# EAGLE schematic VC8E (EAGLE 6.6.0)

## Sheet 1 of 3
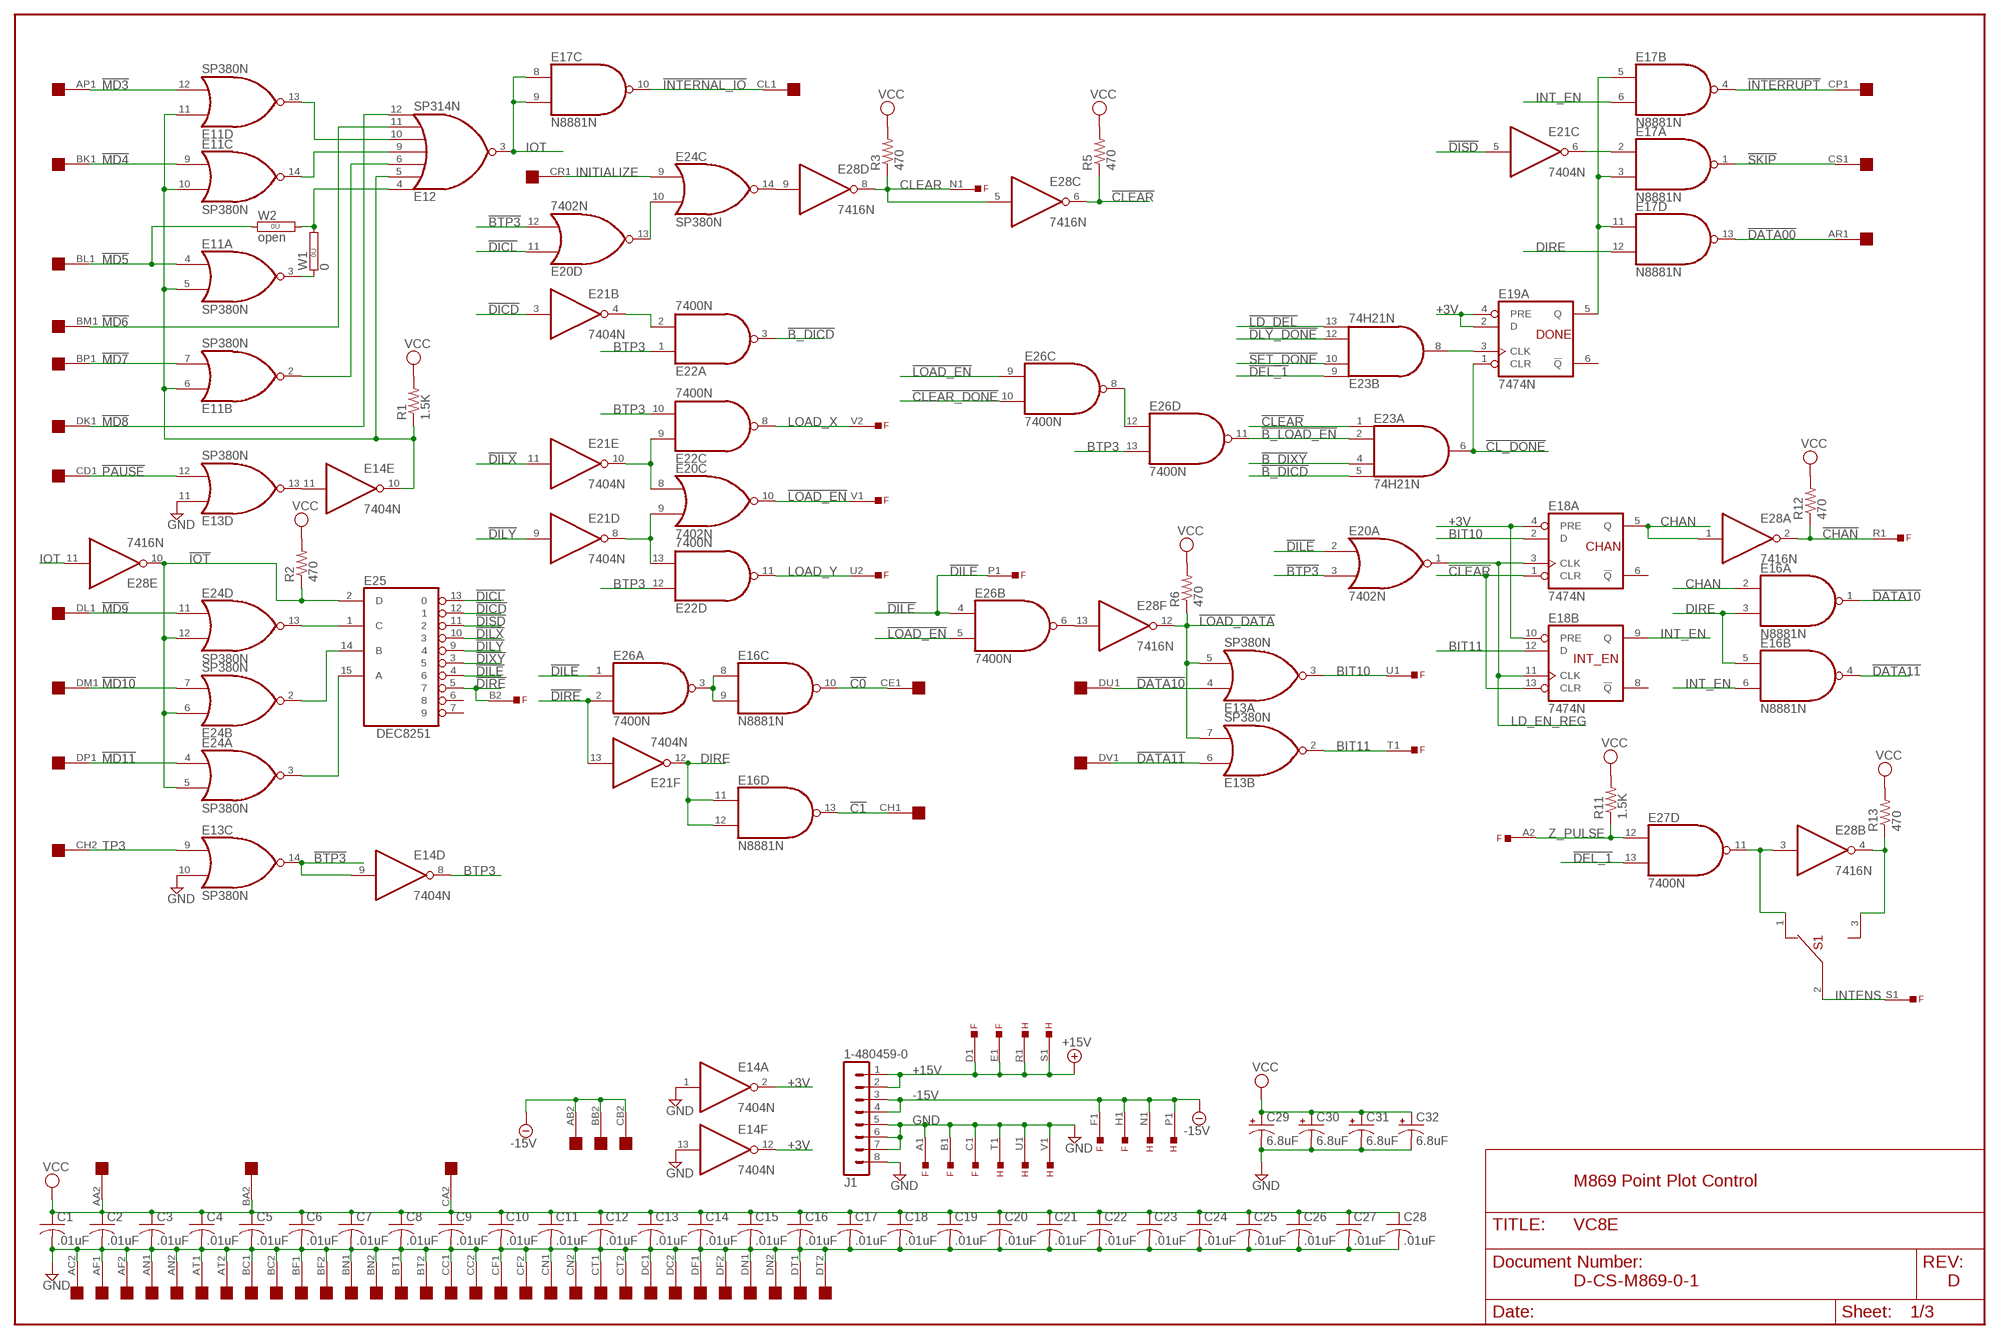
[diagram p0: schematic, sheet 1]

### Parts
C1  .01uF  C-US  [C063-025X075]
C2  .01uF  C-US  [C063-025X075]
C3  .01uF  C-US  [C063-025X075]
C4  .01uF  C-US  [C063-025X075]
C5  .01uF  C-US  [C063-025X075]
C6  .01uF  C-US  [C063-025X075]
C7  .01uF  C-US  [C063-025X075]
C8  .01uF  C-US  [C063-025X075]
C9  .01uF  C-US  [C063-025X075]
C10  .01uF  C-US  [C063-025X075]
C11  .01uF  C-US  [C063-025X075]
C12  .01uF  C-US  [C063-025X075]
C13  .01uF  C-US  [C063-025X075]
C14  .01uF  C-US  [C063-025X075]
C15  .01uF  C-US  [C063-025X075]
C16  .01uF  C-US  [C063-025X075]
C17  .01uF  C-US  [C063-025X075]
C18  .01uF  C-US  [C063-025X075]
C19  .01uF  C-US  [C063-025X075]
C20  .01uF  C-US  [C063-025X075]
C21  .01uF  C-US  [C063-025X075]
C22  .01uF  C-US  [C063-025X075]
C23  .01uF  C-US  [C063-025X075]
C24  .01uF  C-US  [C063-025X075]
C25  .01uF  C-US  [C063-025X075]
C26  .01uF  C-US  [C063-025X075]
C27  .01uF  C-US  [C063-025X075]
C28  .01uF  C-US  [C063-025X075]
C29  6.8uF  CPOL-USE20-8AXIAL  [E12-8]
C30  6.8uF  CPOL-USE20-8AXIAL  [E12-8]
C31  6.8uF  CPOL-USE20-8AXIAL  [E12-8]
C32  6.8uF  CPOL-USE20-8AXIAL  [E12-8]
E11  SP380N  [DIL14]
E12  SP314N  [DIL14]
E13  SP380N  [DIL14]
E14  7404N  [DIL14]
E16  N8881N  [DIL14]
E17  N8881N  [DIL14]
E18  7474N  74S74N  [DIL14]
E19  7474N  74S74N  [DIL14]
E20  7402N  [DIL14]
E21  7404N  [DIL14]
E22  7400N  [DIL14]
E23  74H21N  74LS21N  [DIL14]
E24  SP380N  [DIL14]
E25  DEC8251  [DIL16]
E26  7400N  [DIL14]
E27  7400N  [DIL14]
E28  7416N  [DIL14]
F  EDGE-TOP  [EDGE-CON2]
H  EDGE-TOP  [EDGE-CON2]
J1  1-480459-0  [1-480459-0]
OMNIBUS  QUAD  [EDGE-CON8]
R1  1.5K  R-US_0207/10  [0207/10]
R2  470  R-US_0207/10  [0207/10]
R3  470  R-US_0207/10  [0207/10]
R5  470  R-US_0207/10  [0207/10]
R6  470  R-US_0207/10  [0207/10]
R11  1.5K  R-US_0207/10  [0207/10]
R12  470  R-US_0207/10  [0207/10]
R13  470  R-US_0207/10  [0207/10]
S1  12-09698  [23-021]
W1  0  0R  [0R/10]
W2  open  0R  [0R/10]

### Nets
!B_DICD: E22.3(A:O) E23.5(A:I3)
!B_DIXY: E23.4(A:I2) ; also sheet 2
!B_LOAD_EN: E23.2(A:I1) E26.11(D:O)
!BTP3: E13.14(C:O) E14.9(D:I) E20.3(A:I1) E20.12(D:I1)
!C0: E16.10(C:O) OMNIBUS.CE1
!C1: E16.13(D:O) OMNIBUS.CH1
!CHAN: E28.2(A:O) F.R1 R12.1 ; also sheet 3
!CL_DONE: E19.1(A:CLR) E23.6(A:O)
!CLEAR: E18.1(A:CLR) E18.13(B:CLR) E23.1(A:I0) E28.6(C:O) R5.1 ; also sheet 2
!CLEAR_DONE: E26.10(C:I1) ; also sheet 2
!DATA00: E17.13(D:O) OMNIBUS.AR1
!DATA10: E13.4(A:I0) E16.1(A:O) OMNIBUS.DU1 ; also sheet 3
!DATA11: E13.6(B:I0) E16.4(B:O) OMNIBUS.DV1 ; also sheet 3
!DEL_1: E23.9(B:I0) E27.13(D:I1) ; also sheet 2
!DEL_1Z: E28.4(B:O) R13.1 S1.3(A3)
!DICD: E21.3(B:I) E25.12
!DICL: E20.11(D:I0) E25.13
!DILE: E20.2(A:I0) E25.4 E26.1(A:I0) E26.4(B:I0) F.P1 ; also sheet 3
!DILX: E21.11(E:I) E25.10
!DILY: E21.9(D:I) E25.9
!DIRE: E21.13(F:I) E25.5 E26.2(A:I1) F.B2 ; also sheet 3
!DISD: E21.5(C:I) E25.11
!DIXY: E25.3 ; also sheet 2
!DLY_DONE: E23.12(B:I2) ; also sheet 2
!INTERNAL_IO: E17.10(C:O) OMNIBUS.CL1
!INTERRUPT: E17.4(B:O) OMNIBUS.CP1
!IOT: E24.5(A:I1) E24.6(B:I0) E24.12(D:I1) E25.2(D) E28.10(E:O) R2.1
!LD_DEL: E23.13(B:I3) ; also sheet 2
!LOAD_DATA: E13.5(A:I1) E13.7(B:I1) E28.12(F:O) R6.1 ; also sheet 2
!LOAD_EN: E20.10(C:O) E26.5(B:I1) E26.9(C:I0) F.V1 ; also sheet 2,3
!MD3: E11.12(D:I1) OMNIBUS.AP1
!MD4: E11.9(C:I0) OMNIBUS.BK1
!MD5: E11.4(A:I0) OMNIBUS.BL1 W2.1
!MD6: E12.11(I5) OMNIBUS.BM1
!MD7: E11.7(B:I1) OMNIBUS.BP1
!MD8: E12.12(I6) OMNIBUS.DK1
!MD9: E24.11(D:I0) OMNIBUS.DL1
!MD10: E24.7(B:I1) OMNIBUS.DM1
!MD11: E24.4(A:I0) OMNIBUS.DP1
!PAUSE: E13.12(D:I1) OMNIBUS.CD1
!SET_DONE: E23.10(B:I1) ; also sheet 2
!SKIP: E17.1(A:O) OMNIBUS.CS1
+3V: E14.2(A:O) E14.12(F:O) E18.4(A:PRE) E18.10(B:PRE) E19.2(A:D) E19.4(A:PRE) ; also sheet 2
+15V: F.D1 F.E1 H.R1 H.S1 J1.1 J1.2 ; also sheet 3
-15V [supply]: F.F1 F.H1 H.N1 H.P1 J1.3 J1.4 OMNIBUS.AB2 OMNIBUS.BB2 OMNIBUS.CB2 ; also sheet 3
BIT10: E13.3(A:O) E18.2(A:D) F.U1 ; also sheet 3
BIT11: E13.2(B:O) E18.12(B:D) F.T1 ; also sheet 3
BTP3: E14.8(D:O) E22.1(A:I0) E22.10(C:I1) E22.12(D:I0) E26.13(D:I1) ; also sheet 2
CHAN: E16.2(A:I0) E18.5(A:Q) E28.1(A:I)
CLEAR: E28.5(C:I) E28.8(D:O) F.N1 R3.1 ; also sheet 2,3
DEL_1Z: E27.11(D:O) E28.3(B:I) S1.1(A1)
DICD: E21.4(B:O) E22.2(A:I1)
DILX: E20.8(C:I0) E21.10(E:O) E22.9(C:I0)
DILY: E20.9(C:I1) E21.8(D:O) E22.13(D:I1)
DIRE: E16.3(A:I1) E16.5(B:I0) E16.11(D:I0) E16.12(D:I1) E17.12(D:I1) E21.12(F:O) ; also sheet 2
DISD: E17.2(A:I0) E21.6(C:O)
GND [supply]: C1.2 C2.2 C3.2 C4.2 C5.2 C6.2 C7.2 C8.2 C9.2 C10.2 C11.2 C12.2 C13.2 C14.2 C15.2 C16.2 C17.2 C18.2 C19.2 C20.2 C21.2 C22.2 C23.2 C24.2 C25.2 C26.2 C27.2 C28.2 C29.- C30.- C31.- C32.- E13.10(C:I1) E13.11(D:I0) E14.1(A:I) E14.13(F:I) F.A1 F.B1 F.C1 H.T1 H.U1 H.V1 J1.5 J1.6 J1.7 J1.8 OMNIBUS.AC2 OMNIBUS.AF1 OMNIBUS.AF2 OMNIBUS.AN1 OMNIBUS.AN2 OMNIBUS.AT1 OMNIBUS.AT2 OMNIBUS.BC1 OMNIBUS.BC2 OMNIBUS.BF1 OMNIBUS.BF2 OMNIBUS.BN1 OMNIBUS.BN2 OMNIBUS.BT1 OMNIBUS.BT2 OMNIBUS.CC1 OMNIBUS.CC2 OMNIBUS.CF1 OMNIBUS.CF2 OMNIBUS.CN1 OMNIBUS.CN2 OMNIBUS.CT1 OMNIBUS.CT2 OMNIBUS.DC1 OMNIBUS.DC2 OMNIBUS.DF1 OMNIBUS.DF2 OMNIBUS.DN1 OMNIBUS.DN2 OMNIBUS.DT1 OMNIBUS.DT2 ; also sheet 2,3
INITIALIZE: E24.9(C:I0) OMNIBUS.CR1
INT_EN: E16.6(B:I1) E17.6(B:I1) E18.9(B:Q)
INTENS: F.S1 S1.2(A2) ; also sheet 3
IO3: E11.13(D:O) E12.10(I4)
IO4: E11.14(C:O) E12.9(I3)
IO5: E12.4(I0) W1.2 W2.2
IO7: E11.2(B:O) E12.6(I2)
IOT: E12.3(O) E17.8(C:I0) E17.9(C:I1) E28.11(E:I)
LD_EN_REG: E18.3(A:CLK) E18.11(B:CLK) E20.1(A:O) ; also sheet 2
LOAD_X: E22.8(C:O) F.V2 ; also sheet 3
LOAD_Y: E22.11(D:O) F.U2 ; also sheet 3
MD5: E11.3(A:O) W1.1
N$1: E17.3(A:I1) E17.5(B:I0) E17.11(D:I0) E19.5(A:Q)
N$2: E26.8(C:O) E26.12(D:I0)
N$3: E19.3(A:CLK) E23.8(B:O)
N$4: E16.8(C:I0) E16.9(C:I1) E26.3(A:O)
N$5: E26.6(B:O) E28.13(F:I)
N$16: E13.13(D:O) E14.11(E:I)
N$18: E24.14(C:O) E28.9(D:I)
N$19: E24.3(A:O) E25.15(A)
N$20: E24.2(B:O) E25.14(B)
N$21: E24.13(D:O) E25.1(C)
N$23: E20.13(D:O) E24.10(C:I1)
PAUSE_L: E11.5(A:I1) E11.6(B:I0) E11.10(C:I1) E11.11(D:I0) E12.5(I1) E14.10(E:O) R1.1
TP3: E13.9(C:I0) OMNIBUS.CH2
VCC [supply]: C1.1 C2.1 C3.1 C4.1 C5.1 C6.1 C7.1 C8.1 C9.1 C10.1 C11.1 C12.1 C13.1 C14.1 C15.1 C16.1 C17.1 C18.1 C19.1 C20.1 C21.1 C22.1 C23.1 C24.1 C25.1 C26.1 C27.1 C28.1 C29.+ C30.+ C31.+ C32.+ OMNIBUS.AA2 OMNIBUS.BA2 OMNIBUS.CA2 R1.2 R2.2 R3.2 R5.2 R6.2 R11.2 R12.2 R13.2 ; also sheet 2,3
Z_PULSE: E27.12(D:I0) F.A2 R11.1 ; also sheet 3
Unconnected: E14.3(B:I) E14.4(B:O) E14.5(C:I) E14.6(C:O) E18.6(A:!Q) E18.8(B:!Q) E19.6(A:!Q) E19.8(B:!Q) E19.9(B:Q) E19.10(B:PRE) E19.11(B:CLK) E19.12(B:D) E19.13(B:CLR) E20.4(B:O) E20.5(B:I0) E20.6(B:I1) E25.6 E25.7 E27.1(A:I0) E27.2(A:I1) E27.3(A:O) E27.4(B:I0) E27.5(B:I1) E27.6(B:O) E27.8(C:O) E27.9(C:I0) E27.10(C:I1) F.E2 F.F2 F.H2 F.J1 F.J2 F.K2 F.L2 F.M2 F.N2 F.P2 F.R2 F.S2 F.T2 H.A1 H.A2 H.B1 H.B2 H.C1 H.C2 H.D1 H.D2 H.E1 H.E2 H.F1 H.F2 H.H1 H.H2 H.J1 H.J2 H.K1 H.K2 H.L1 H.L2 H.M1 H.M2 H.N2 H.P2 H.R2 H.S2 H.T2 H.U2 H.V2 OMNIBUS.AA1 OMNIBUS.AB1 OMNIBUS.AC1 OMNIBUS.AD1 OMNIBUS.AD2 OMNIBUS.AE1 OMNIBUS.AE2 OMNIBUS.AH1 OMNIBUS.AH2 OMNIBUS.AJ1 OMNIBUS.AJ2 OMNIBUS.AK1 OMNIBUS.AK2 OMNIBUS.AL1 OMNIBUS.AL2 OMNIBUS.AM1 OMNIBUS.AM2 OMNIBUS.AP2 OMNIBUS.AR2 OMNIBUS.AS1 OMNIBUS.AS2 OMNIBUS.AU1 OMNIBUS.AU2 OMNIBUS.AV1 OMNIBUS.AV2 OMNIBUS.BA1 OMNIBUS.BB1 OMNIBUS.BD1 OMNIBUS.BD2 OMNIBUS.BE1 OMNIBUS.BE2 OMNIBUS.BH1 OMNIBUS.BH2 OMNIBUS.BJ1 OMNIBUS.BJ2 OMNIBUS.BK2 OMNIBUS.BL2 OMNIBUS.BM2 OMNIBUS.BP2 OMNIBUS.BR1 OMNIBUS.BR2 OMNIBUS.BS1 OMNIBUS.BS2 OMNIBUS.BU2 OMNIBUS.BV2 OMNIBUS.CA1 OMNIBUS.CB1 OMNIBUS.CD2 OMNIBUS.CE2 OMNIBUS.CJ1 OMNIBUS.CJ2 OMNIBUS.CK1 OMNIBUS.CK2 OMNIBUS.CL2 OMNIBUS.CM1 OMNIBUS.CM2 OMNIBUS.CP2 OMNIBUS.CR2 OMNIBUS.CS2 OMNIBUS.CU1 OMNIBUS.CU2 OMNIBUS.CV1 OMNIBUS.CV2 OMNIBUS.DA1 OMNIBUS.DA2 OMNIBUS.DB1 OMNIBUS.DB2 OMNIBUS.DD1 OMNIBUS.DD2 OMNIBUS.DE1 OMNIBUS.DE2 OMNIBUS.DH1 OMNIBUS.DH2 OMNIBUS.DJ1 OMNIBUS.DJ2 OMNIBUS.DK2 OMNIBUS.DL2 OMNIBUS.DM2 OMNIBUS.DP2 OMNIBUS.DR2 OMNIBUS.DS2 OMNIBUS.DU2 OMNIBUS.DV2

### Notes on the sheet
- DONE
- CHAN
- INT_EN
- M869 Point Plot Control
- D-CS-M869-0-1 | D

## Sheet 2 of 3
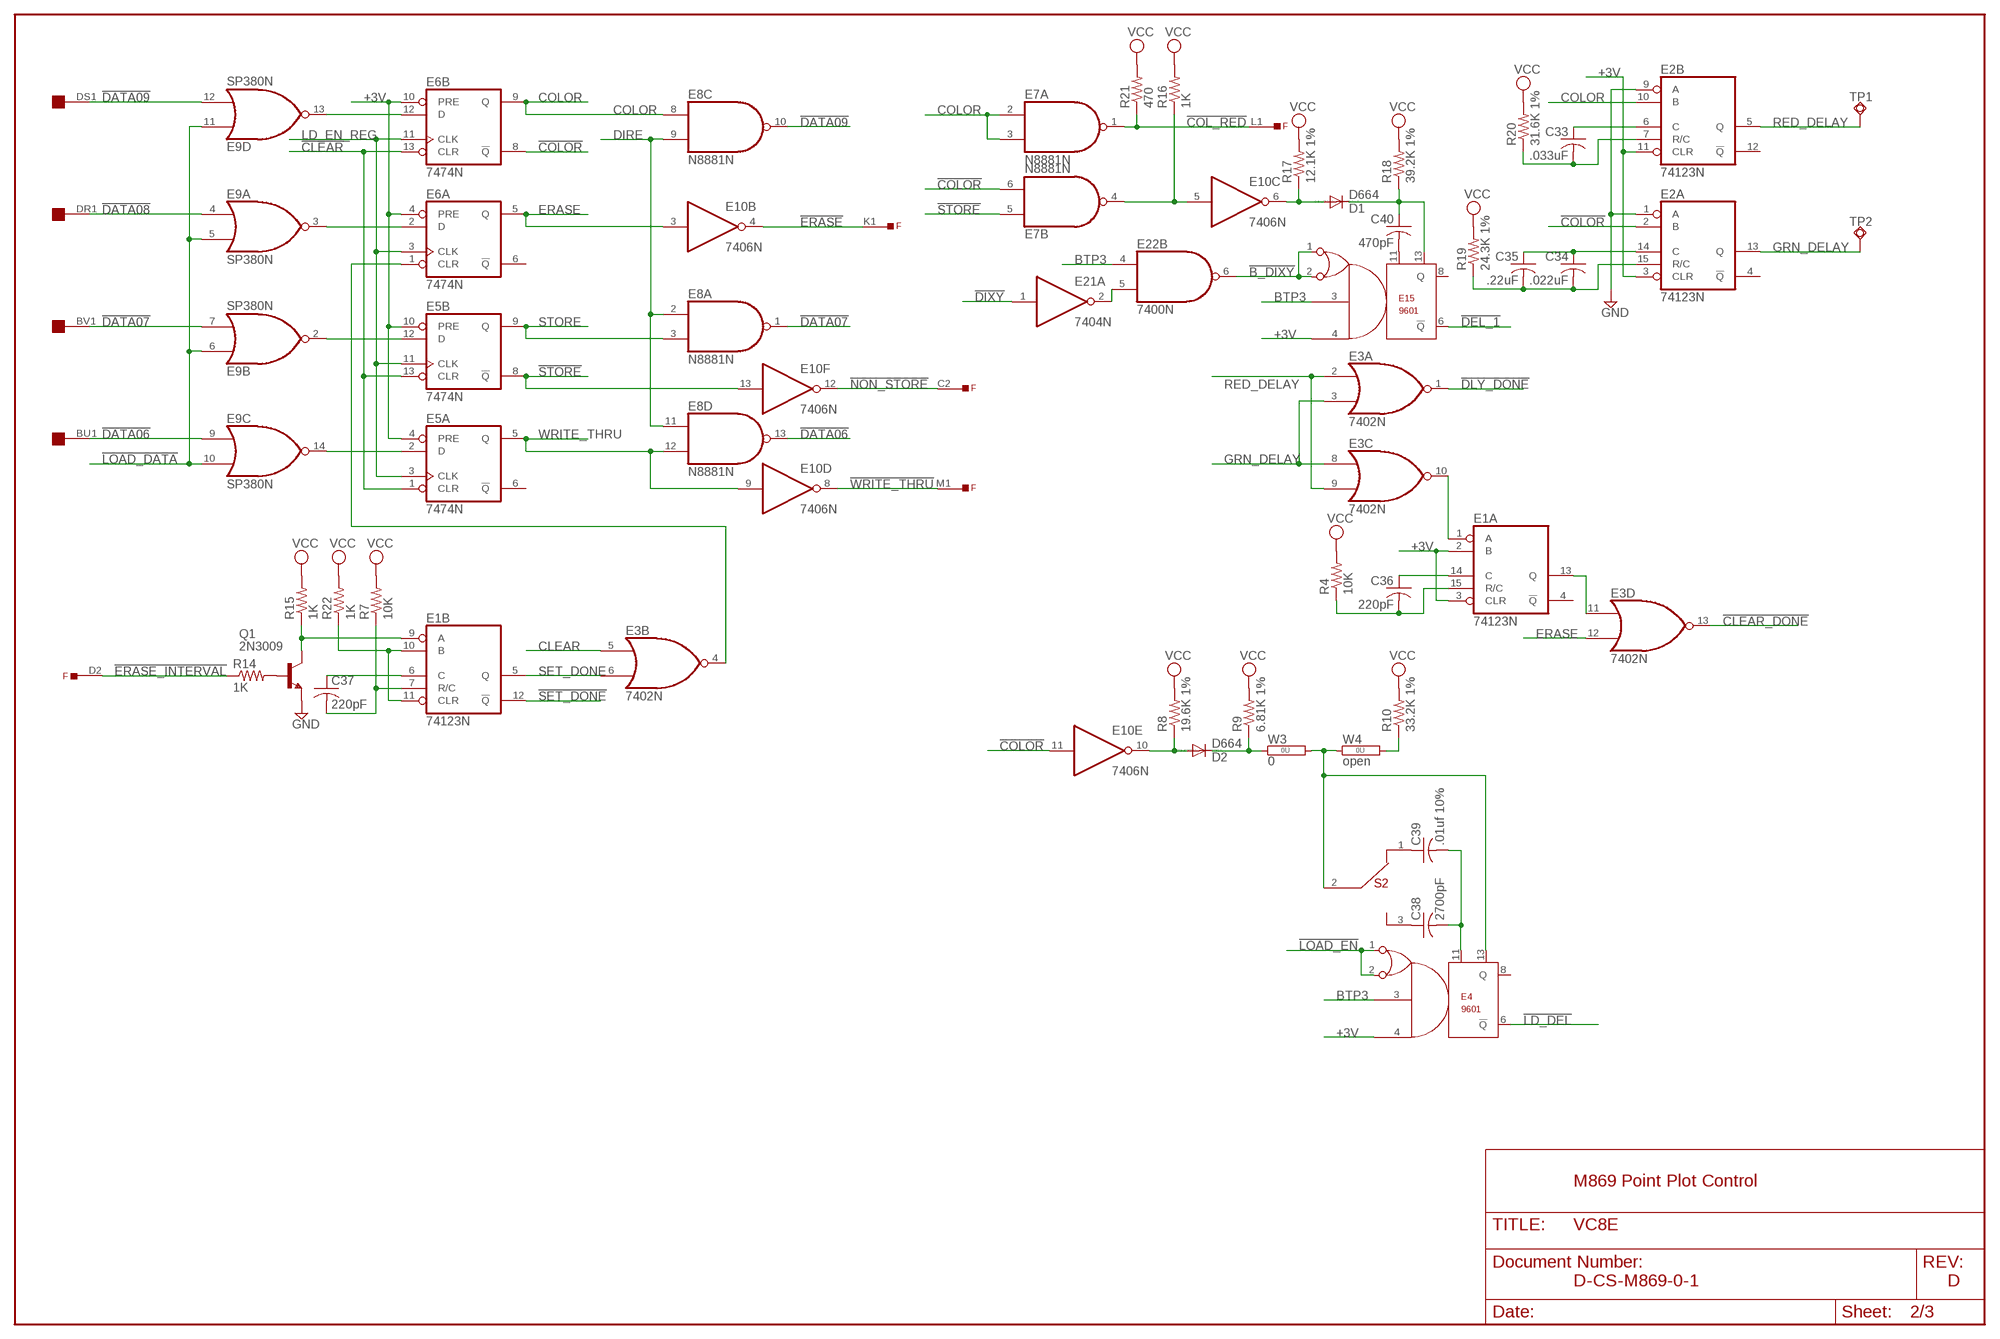
[diagram p1: schematic, sheet 2]

### Parts
C33  .033uF  C-US325-137X374  [C325-137X374]
C34  .022uF  C-US8  [C203-054-229]
C35  .22uF  C-US8  [C203-054-229]
C36  220pF  C-US  [C063-025X075]
C37  220pF  C-US  [C063-025X075]
C38  2700pF  C-US102-043X133  [C102-043X133]
C39  .01uf 10%  C-US  [C063-025X075]
C40  470pF  C-US  [C063-025X075]
D1  D664  DIODE-DO35-10  [DO35-10]
D2  D664  DIODE-DO35-10  [DO35-10]
E1  74123N  [DIL16]
E2  74123N  [DIL16]
E3  7402N  [DIL14]
E4  9601  [DIL14]
E5  7474N  74S74N  [DIL14]
E6  7474N  74S74N  [DIL14]
E7  N8881N  [DIL14]
E8  N8881N  [DIL14]
E9  SP380N  [DIL14]
E10  7406N  [DIL14]
E15  9601  [DIL14]
Q1  2N3009  -NPN-TO18-  [TO18-]
R4  10K  R-US_0207/10  [0207/10]
R7  10K  R-US_0207/10  [0207/10]
R8  19.6K 1%  R-US_0207/15  [0207/15]
R9  6.81K 1%  R-US_0207/15  [0207/15]
R10  33.2K 1%  R-US_0207/15  [0207/15]
R14  1K  R-US_0207/10  [0207/10]
R15  1K  R-US_0207/10  [0207/10]
R16  1K  R-US_0207/10  [0207/10]
R17  12.1K 1%  R-US_0207/15  [0207/15]
R18  39.2K 1%  R-US_0207/15  [0207/15]
R19  24.3K 1%  R-US_0207/15  [0207/15]
R20  31.6K 1%  R-US_0207/15  [0207/15]
R21  470  R-US_0207/10  [0207/10]
R22  1K  R-US_0207/10  [0207/10]
S2  12-09698  [23-021]
TP1  TPSQPAD1-17  [P1-17]
TP2  TPSQPAD1-17  [P1-17]
W3  0  0R  [0R/10]
W4  open  0R  [0R/10]

### Nets
!B_DIXY: E15.1 E15.2 E22.6(B:O) ; also sheet 1
!CLEAR: E5.1(A:CLR) E5.13(B:CLR) E6.13(B:CLR) ; also sheet 1
!CLEAR_DONE: E3.13(D:O) ; also sheet 1
!COL_RED: E7.1(A:O) F.L1 R21.1 ; also sheet 3
!COLOR: E2.2(A:B) E6.8(B:!Q) E7.6(B:I1) E10.11(E:I)
!DATA06: E8.13(D:O) E9.9(C:I0) OMNIBUS.BU1 ; also sheet 3
!DATA07: E8.1(A:O) E9.7(B:I1) OMNIBUS.BV1 ; also sheet 3
!DATA08: E9.4(A:I0) OMNIBUS.DR1 ; also sheet 3
!DATA09: E8.10(C:O) E9.12(D:I1) OMNIBUS.DS1 ; also sheet 3
!DEL_1: E15.6(!Q) ; also sheet 1
!DIXY: E21.1(A:I) ; also sheet 1
!DLY_DONE: E3.1(A:O) ; also sheet 1
!ERASE: E10.4(B:O) F.K1 ; also sheet 3
!ERASE_INTERVAL: F.D2 R14.1 ; also sheet 3
!LD_DEL: E4.6(!Q) ; also sheet 1
!LOAD_DATA: E9.5(A:I1) E9.6(B:I0) E9.10(C:I1) E9.11(D:I0) ; also sheet 1
!LOAD_EN: E4.1 E4.2 ; also sheet 1,3
!NON_STORE: E10.12(F:O) F.C2 ; also sheet 3
!SET_DONE: E1.12(B:!Q) ; also sheet 1
!STORE: E5.8(B:!Q) E7.5(B:I0) E10.13(F:I)
!WRITE_THRU: E10.8(D:O) F.M1 ; also sheet 3
+3V: E1.2(A:B) E1.3(A:CLR) E2.3(A:CLR) E2.11(B:CLR) E4.4 E5.4(A:PRE) E5.10(B:PRE) E6.4(A:PRE) E6.10(B:PRE) E15.4 ; also sheet 1
BCOLOR: D2.A E10.10(E:O) R8.1
BTP3: E4.3 E15.3 E22.4(B:I0) ; also sheet 1
CLEAR: E3.5(B:I0) ; also sheet 1,3
COLOR: E2.10(B:B) E6.9(B:Q) E7.2(A:I0) E7.3(A:I1) E8.8(C:I0)
DDELAY: E1.13(A:Q) E3.11(D:I0)
DIRE: E8.2(A:I0) E8.9(C:I1) E8.11(D:I0) ; also sheet 1
DLY_DN: E1.1(A:A) E3.10(C:O)
ERASE: E3.12(D:I1) E6.5(A:Q) E10.3(B:I)
GDELAY: D1.A E10.6(C:O) R17.1
GND [supply]: E2.1(A:A) E2.9(B:A) Q1.1(E) ; also sheet 1,3
GRN_DELAY: E2.13(A:Q) E3.3(A:I1) E3.8(C:I0) TP2.TP
LD_EN_REG: E5.3(A:CLK) E5.11(B:CLK) E6.3(A:CLK) E6.11(B:CLK) ; also sheet 1
N$7: E21.2(A:O) E22.5(B:I1)
N$11: E6.12(B:D) E9.13(D:O)
N$13: E5.2(A:D) E9.14(C:O)
N$22: E5.12(B:D) E9.2(B:O)
N$24: E6.2(A:D) E9.3(A:O)
N$25: E7.4(B:O) E10.5(C:I) R16.1
N$26: E3.4(B:O) E6.1(A:CLR)
N$28: C40.1 D1.C E15.13 R18.1
N$29: C40.2 E15.11
N$30: C34.2 C35.2 E2.15(A:R/C) R19.1
N$31: C33.2 E2.7(B:R/C) R20.1
N$32: C33.1 E2.6(B:C)
N$33: C34.1 C35.1 E2.14(A:C)
N$36: C36.2 E1.15(A:R/C) R4.1
N$37: C36.1 E1.14(A:C)
N$38: Q1.2(B) R14.2
N$39: E1.9(B:A) Q1.3(C) R15.1
N$40: E1.10(B:B) E1.11(B:CLR) R22.1
N$41: C37.2 E1.7(B:R/C) R7.1
N$42: C37.1 E1.6(B:C)
N$44: D2.C R9.1 W3.1
N$45: E4.13 S2.2(A2) W3.2 W4.1
N$46: R10.1 W4.2
N$47: C39.1 S2.1(A1)
N$48: C38.1 S2.3(A3)
N$49: C38.2 C39.2 E4.11
RED_DELAY: E2.5(B:Q) E3.2(A:I0) E3.9(C:I1) TP1.TP
SET_DONE: E1.5(B:Q) E3.6(B:I1)
STORE: E5.9(B:Q) E8.3(A:I1)
VCC [supply]: R4.2 R7.2 R8.2 R9.2 R10.2 R15.2 R16.2 R17.2 R18.2 R19.2 R20.2 R21.2 R22.2 ; also sheet 1,3
WRITE_THRU: E5.5(A:Q) E8.12(D:I1) E10.9(D:I)
Unconnected: E1.4(A:!Q) E2.4(A:!Q) E2.12(B:!Q) E4.8(Q) E5.6(A:!Q) E6.6(A:!Q) E7.8(C:I0) E7.9(C:I1) E7.10(C:O) E7.11(D:I0) E7.12(D:I1) E7.13(D:O) E8.4(B:O) E8.5(B:I0) E8.6(B:I1) E10.1(A:I) E10.2(A:O) E15.8(Q)

### Notes on the sheet
- M869 Point Plot Control
- D-CS-M869-0-1 | D

## Sheet 3 of 3
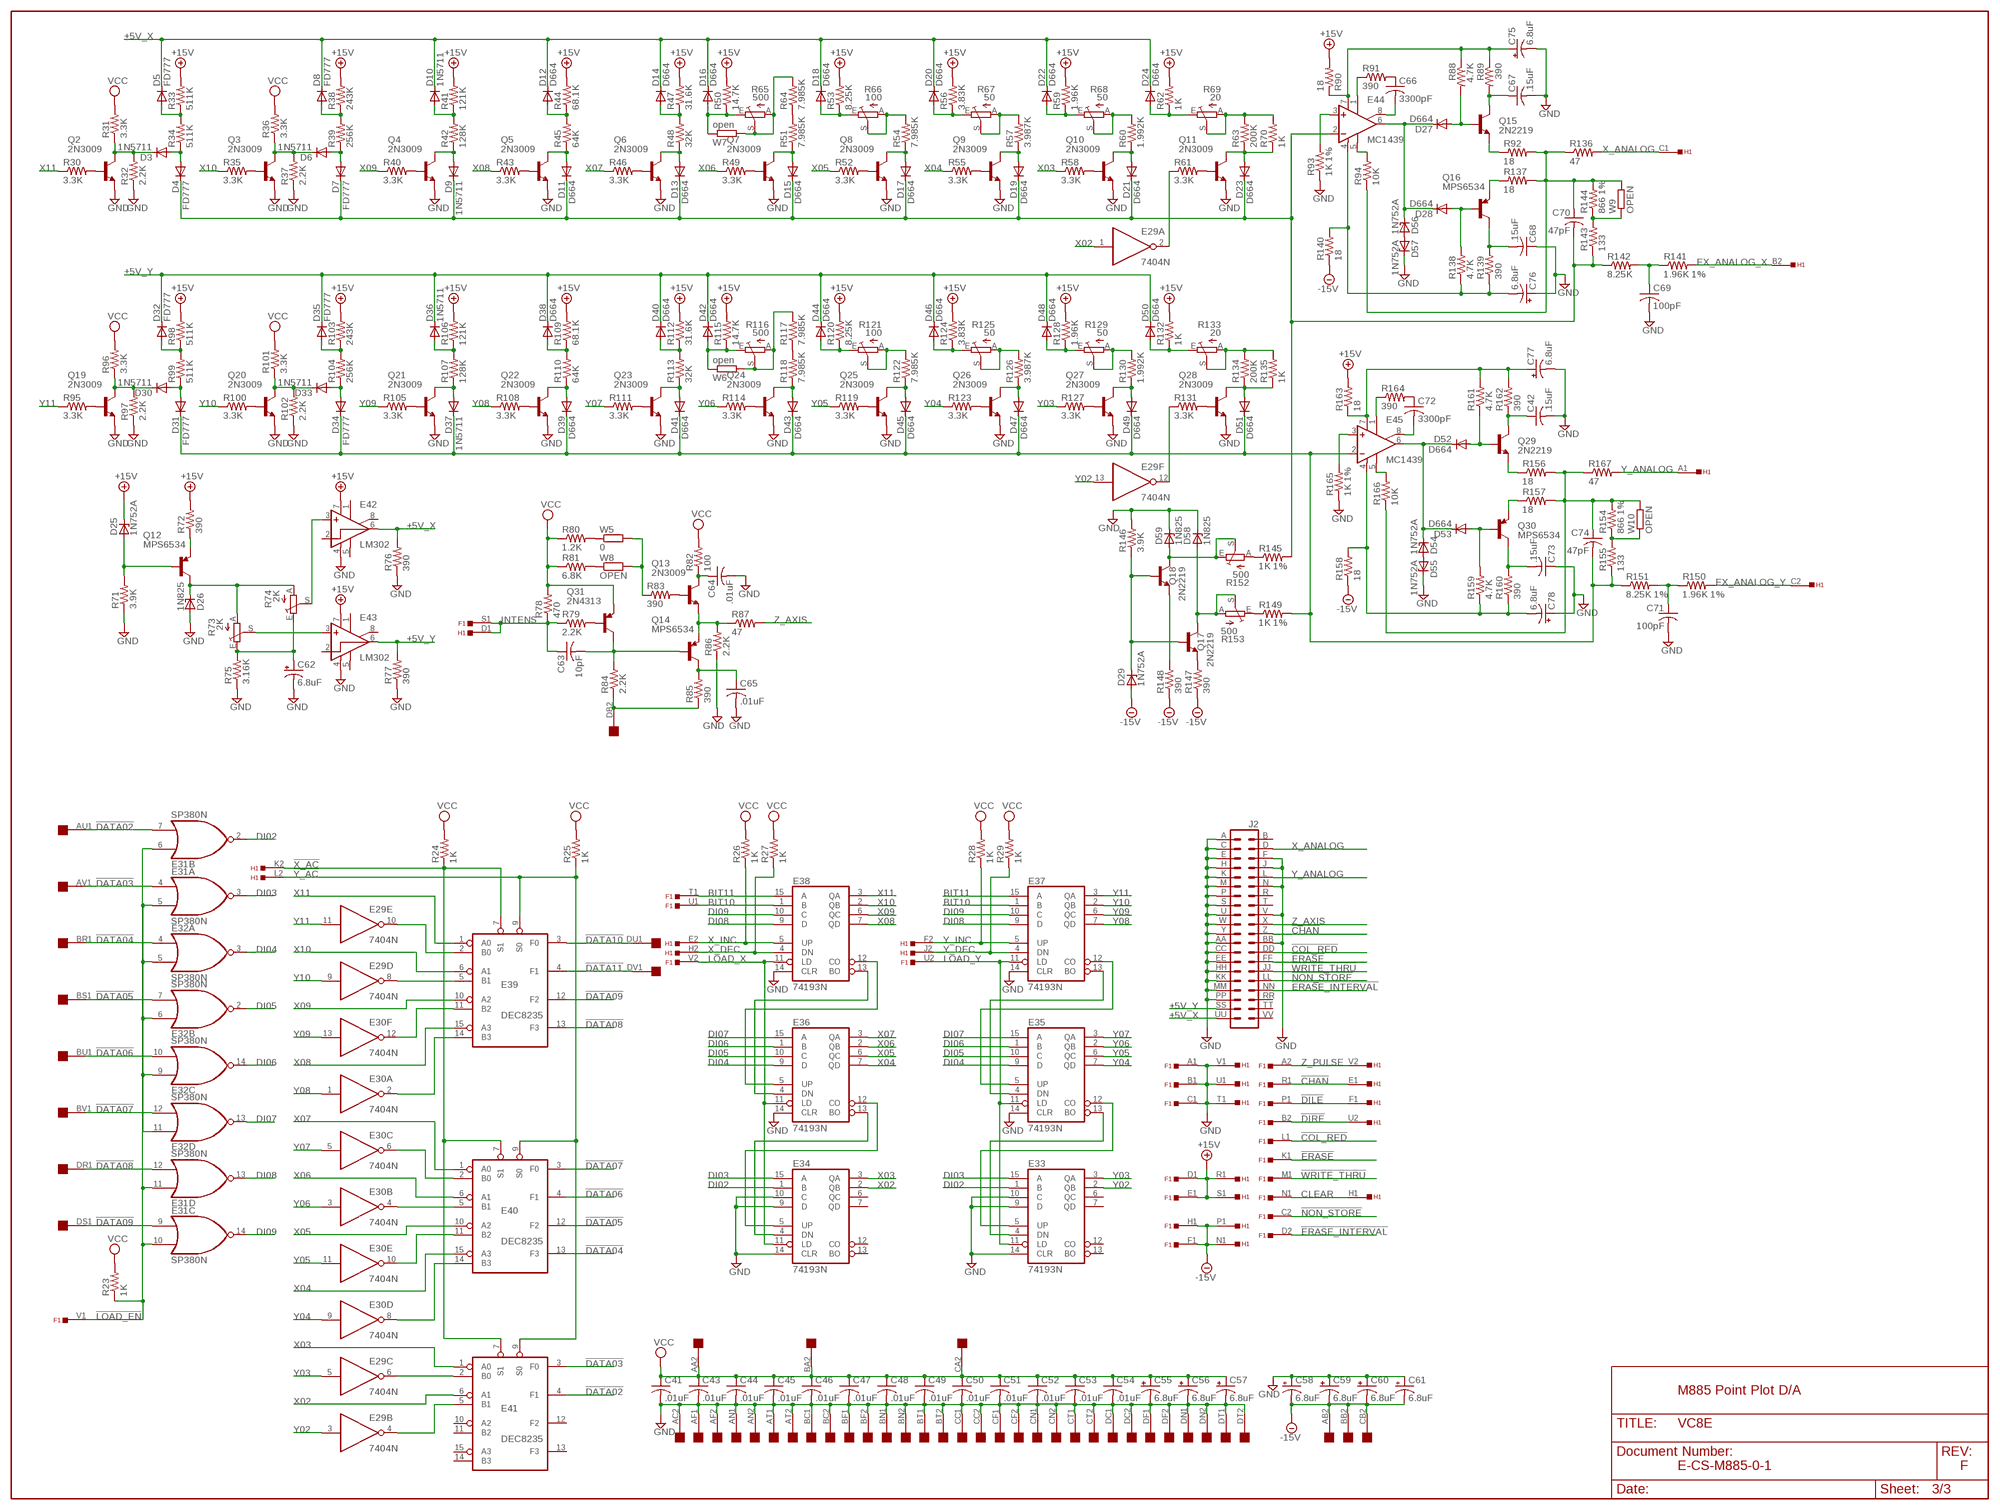
[diagram p2: schematic, sheet 3]

### Parts
C41  .01uF  C-US  [C063-025X075]
C42  .15uF  C-US150-054X183  [C150-054X183]
C43  .01uF  C-US  [C063-025X075]
C44  .01uF  C-US  [C063-025X075]
C45  .01uF  C-US  [C063-025X075]
C46  .01uF  C-US  [C063-025X075]
C47  .01uF  C-US  [C063-025X075]
C48  .01uF  C-US  [C063-025X075]
C49  .01uF  C-US  [C063-025X075]
C50  .01uF  C-US  [C063-025X075]
C51  .01uF  C-US  [C063-025X075]
C52  .01uF  C-US  [C063-025X075]
C53  .01uF  C-US  [C063-025X075]
C54  .01uF  C-US  [C063-025X075]
C55  6.8uF  CPOL-USE20-8AXIAL  [E12-8]
C56  6.8uF  CPOL-USE20-8AXIAL  [E12-8]
C57  6.8uF  CPOL-USE20-8AXIAL  [E12-8]
C58  6.8uF  CPOL-USE20-8AXIAL  [E12-8]
C59  6.8uF  CPOL-USE20-8AXIAL  [E12-8]
C60  6.8uF  CPOL-USE20-8AXIAL  [E12-8]
C61  6.8uF  CPOL-USE20-8AXIAL  [E12-8]
C62  6.8uF  CPOL-USE20-8AXIAL  [E12-8]
C63  10pF  C-US  [C063-025X075]
C64  .01uF  C-US  [C063-025X075]
C65  .01uF  C-US  [C063-025X075]
C66  3300pF  C-US150-054X183  [C150-054X183]
C67  .15uF  C-US150-054X183  [C150-054X183]
C68  .15uF  C-US150-054X183  [C150-054X183]
C69  100pF  C-US  [C063-025X075]
C70  47pF  C-US  [C063-025X075]
C71  100pF  C-US  [C063-025X075]
C72  3300pF  C-US150-054X183  [C150-054X183]
C73  .15uF  C-US150-054X183  [C150-054X183]
C74  47pF  C-US  [C063-025X075]
C75  6.8uF  CPOL-USE20-8AXIAL  [E12-8]
C76  6.8uF  CPOL-USE20-8AXIAL  [E12-8]
C77  6.8uF  CPOL-USE20-8AXIAL  [E12-8]
C78  6.8uF  CPOL-USE20-8AXIAL  [E12-8]
D3  1N5711  DIODE-DO35-10  [DO35-10]
D4  FD777  DIODE-DO35-10  [DO35-10]
D5  FD777  DIODE-DO35-10  [DO35-10]
D6  1N5711  DIODE-DO35-10  [DO35-10]
D7  FD777  DIODE-DO35-10  [DO35-10]
D8  FD777  DIODE-DO35-10  [DO35-10]
D9  1N5711  DIODE-DO35-10  [DO35-10]
D10  1N5711  DIODE-DO35-10  [DO35-10]
D11  D664  DIODE-DO35-10  [DO35-10]
D12  D664  DIODE-DO35-10  [DO35-10]
D13  D664  DIODE-DO35-10  [DO35-10]
D14  D664  DIODE-DO35-10  [DO35-10]
D15  D664  DIODE-DO35-10  [DO35-10]
D16  D664  DIODE-DO35-10  [DO35-10]
D17  D664  DIODE-DO35-10  [DO35-10]
D18  D664  DIODE-DO35-10  [DO35-10]
D19  D664  DIODE-DO35-10  [DO35-10]
D20  D664  DIODE-DO35-10  [DO35-10]
D21  D664  DIODE-DO35-10  [DO35-10]
D22  D664  DIODE-DO35-10  [DO35-10]
D23  D664  DIODE-DO35-10  [DO35-10]
D24  D664  DIODE-DO35-10  [DO35-10]
D25  1N752A  ZENER-DIODEDO35Z10  [DO35Z10]
D26  1N825  ZENER-DIODEDO35Z10  [DO35Z10]
D27  D664  DIODE-DO35-10  [DO35-10]
D28  D664  DIODE-DO35-10  [DO35-10]
D29  1N752A  ZENER-DIODEDO35Z10  [DO35Z10]
D30  1N5711  DIODE-DO35-10  [DO35-10]
D31  FD777  DIODE-DO35-10  [DO35-10]
D32  FD777  DIODE-DO35-10  [DO35-10]
D33  1N5711  DIODE-DO35-10  [DO35-10]
D34  FD777  DIODE-DO35-10  [DO35-10]
D35  FD777  DIODE-DO35-10  [DO35-10]
D36  1N5711  DIODE-DO35-10  [DO35-10]
D37  1N5711  DIODE-DO35-10  [DO35-10]
D38  D664  DIODE-DO35-10  [DO35-10]
D39  D664  DIODE-DO35-10  [DO35-10]
D40  D664  DIODE-DO35-10  [DO35-10]
D41  D664  DIODE-DO35-10  [DO35-10]
D42  D664  DIODE-DO35-10  [DO35-10]
D43  D664  DIODE-DO35-10  [DO35-10]
D44  D664  DIODE-DO35-10  [DO35-10]
D45  D664  DIODE-DO35-10  [DO35-10]
D46  D664  DIODE-DO35-10  [DO35-10]
D47  D664  DIODE-DO35-10  [DO35-10]
D48  D664  DIODE-DO35-10  [DO35-10]
D49  D664  DIODE-DO35-10  [DO35-10]
D50  D664  DIODE-DO35-10  [DO35-10]
D51  D664  DIODE-DO35-10  [DO35-10]
D52  D664  DIODE-DO35-10  [DO35-10]
D53  D664  DIODE-DO35-10  [DO35-10]
D54  1N752A  ZENER-DIODEDO35Z10  [DO35Z10]
D55  1N752A  ZENER-DIODEDO35Z10  [DO35Z10]
D56  1N752A  ZENER-DIODEDO35Z10  [DO35Z10]
D57  1N752A  ZENER-DIODEDO35Z10  [DO35Z10]
D58  1N825  ZENER-DIODEDO35Z10  [DO35Z10]
D59  1N825  ZENER-DIODEDO35Z10  [DO35Z10]
E29  7404N  [DIL14]
E30  7404N  [DIL14]
E31  SP380N  [DIL14]
E32  SP380N  [DIL14]
E33  74193N  [DIL16]
E34  74193N  [DIL16]
E35  74193N  [DIL16]
E36  74193N  [DIL16]
E37  74193N  [DIL16]
E38  74193N  [DIL16]
E39  DEC8235  [DIL16]
E40  DEC8235  [DIL16]
E41  DEC8235  [DIL16]
E42  LM302  AD504H  [TO99]
E43  LM302  AD504H  [TO99]
E44  MC1439  AD504H  [TO99]
E45  MC1439  AD504H  [TO99]
F1  EDGE-TOP  [EDGE-CON2]
H1  EDGE-TOP  [EDGE-CON2]
J2  DEC40PINH  [DEC40PINH]
OMNIBUS1  QUAD  [EDGE-CON8]
Q2  2N3009  -NPN-TO5  [TO5]
Q3  2N3009  -NPN-TO5  [TO5]
Q4  2N3009  -NPN-TO5  [TO5]
Q5  2N3009  -NPN-TO5  [TO5]
Q6  2N3009  -NPN-TO5  [TO5]
Q7  2N3009  -NPN-TO5  [TO5]
Q8  2N3009  -NPN-TO5  [TO5]
Q9  2N3009  -NPN-TO5  [TO5]
Q10  2N3009  -NPN-TO5  [TO5]
Q11  2N3009  -NPN-TO5  [TO5]
Q12  MPS6534  -PNP-TO5  [TO5]
Q13  2N3009  -NPN-TO5  [TO5]
Q14  MPS6534  -PNP-TO5  [TO5]
Q15  2N2219  -NPN-TO5  [TO5]
Q16  MPS6534  -PNP-TO5  [TO5]
Q17  2N2219  -NPN-TO5  [TO5]
Q18  2N2219  -NPN-TO5  [TO5]
Q19  2N3009  -NPN-TO5  [TO5]
Q20  2N3009  -NPN-TO5  [TO5]
Q21  2N3009  -NPN-TO5  [TO5]
Q22  2N3009  -NPN-TO5  [TO5]
Q23  2N3009  -NPN-TO5  [TO5]
Q24  2N3009  -NPN-TO5  [TO5]
Q25  2N3009  -NPN-TO5  [TO5]
Q26  2N3009  -NPN-TO5  [TO5]
Q27  2N3009  -NPN-TO5  [TO5]
Q28  2N3009  -NPN-TO5  [TO5]
Q29  2N2219  -NPN-TO5  [TO5]
Q30  MPS6534  -PNP-TO5  [TO5]
Q31  2N4313  -PNP-TO5  [TO5]
R23  1K  R-US_0207/10  [0207/10]
R24  1K  R-US_0207/10  [0207/10]
R25  1K  R-US_0207/10  [0207/10]
R26  1K  R-US_0207/10  [0207/10]
R27  1K  R-US_0207/10  [0207/10]
R28  1K  R-US_0207/10  [0207/10]
R29  1K  R-US_0207/10  [0207/10]
R30  3.3K  R-US_0207/10  [0207/10]
R31  3.3K  R-US_0207/10  [0207/10]
R32  2.2K  R-US_0207/10  [0207/10]
R33  511K  R-US_0207/15  [0207/15]
R34  511K  R-US_0207/15  [0207/15]
R35  3.3K  R-US_0207/10  [0207/10]
R36  3.3K  R-US_0207/10  [0207/10]
R37  2.2K  R-US_0207/10  [0207/10]
R38  243K  R-US_0207/15  [0207/15]
R39  256K  R-US_0207/15  [0207/15]
R40  3.3K  R-US_0207/10  [0207/10]
R41  121K  R-US_0207/15  [0207/15]
R42  128K  R-US_0207/15  [0207/15]
R43  3.3K  R-US_0207/10  [0207/10]
R44  68.1K  R-US_0207/15  [0207/15]
R45  64K  R-US_0207/15  [0207/15]
R46  3.3K  R-US_0207/10  [0207/10]
R47  31.6K  R-US_0207/15  [0207/15]
R48  32K  R-US_0207/15  [0207/15]
R49  3.3K  R-US_0207/10  [0207/10]
R50  14.7K  R-US_0207/15  [0207/15]
R51  7.985K  R-US_0207/15  [0207/15]
R52  3.3K  R-US_0207/10  [0207/10]
R53  8.25K  R-US_0207/15  [0207/15]
R54  7.985K  R-US_0207/15  [0207/15]
R55  3.3K  R-US_0207/10  [0207/10]
R56  3.83K  R-US_0207/15  [0207/15]
R57  3.987K  R-US_0207/15  [0207/15]
R58  3.3K  R-US_0207/10  [0207/10]
R59  1.96K  R-US_0207/15  [0207/15]
R60  1.992K  R-US_0207/15  [0207/15]
R61  3.3K  R-US_0207/10  [0207/10]
R62  1K  R-US_0207/15  [0207/15]
R63  200K  R-US_0207/15  [0207/15]
R64  7.985K  R-US_0207/15  [0207/15]
R65  500  TRIM_EU-S75P  [S75P]
R66  100  TRIM_EU-S75P  [S75P]
R67  50  TRIM_EU-S75P  [S75P]
R68  50  TRIM_EU-S75P  [S75P]
R69  20  TRIM_EU-S75P  [S75P]
R70  1K  R-US_0207/15  [0207/15]
R71  3.9K  R-US_0207/10  [0207/10]
R72  390  R-US_0207/10  [0207/10]
R73  2K  TRIM_EU-B90P  [SP19L]
R74  2K  TRIM_EU-B90P  [SP19L]
R75  3.16K  R-US_0207/15  [0207/15]
R76  390  R-US_0207/10  [0207/10]
R77  390  R-US_0207/10  [0207/10]
R78  470  R-US_0207/10  [0207/10]
R79  2.2K  R-US_0207/10  [0207/10]
R80  1.2K  R-US_0207/10  [0207/10]
R81  6.8K  R-US_0207/10  [0207/10]
R82  100  R-US_0207/10  [0207/10]
R83  390  R-US_0207/10  [0207/10]
R84  2.2K  R-US_0207/10  [0207/10]
R85  390  R-US_0207/10  [0207/10]
R86  2.2K  R-US_0207/10  [0207/10]
R87  47  R-US_0207/10  [0207/10]
R88  4.7K  R-US_0207/10  [0207/10]
R89  390  R-US_0207/10  [0207/10]
R90  18  R-US_0207/10  [0207/10]
R91  390  R-US_0207/10  [0207/10]
R92  18  R-US_0207/10  [0207/10]
R93  1K 1%  R-US_0207/15  [0207/15]
R94  10K  R-US_0207/10  [0207/10]
R95  3.3K  R-US_0207/10  [0207/10]
R96  3.3K  R-US_0207/10  [0207/10]
R97  2.2K  R-US_0207/10  [0207/10]
R98  511K  R-US_0207/15  [0207/15]
R99  511K  R-US_0207/15  [0207/15]
R100  3.3K  R-US_0207/10  [0207/10]
R101  3.3K  R-US_0207/10  [0207/10]
R102  2.2K  R-US_0207/10  [0207/10]
R103  243K  R-US_0207/15  [0207/15]
R104  256K  R-US_0207/15  [0207/15]
R105  3.3K  R-US_0207/10  [0207/10]
R106  121K  R-US_0207/15  [0207/15]
R107  128K  R-US_0207/15  [0207/15]
R108  3.3K  R-US_0207/10  [0207/10]
R109  68.1K  R-US_0207/15  [0207/15]
R110  64K  R-US_0207/15  [0207/15]
R111  3.3K  R-US_0207/10  [0207/10]
R112  31.6K  R-US_0207/15  [0207/15]
R113  32K  R-US_0207/15  [0207/15]
R114  3.3K  R-US_0207/10  [0207/10]
R115  14.7K  R-US_0207/15  [0207/15]
R116  500  TRIM_EU-S75P  [S75P]
R117  7.985K  R-US_0207/15  [0207/15]
R118  7.985K  R-US_0207/15  [0207/15]
R119  3.3K  R-US_0207/10  [0207/10]
R120  8.25K  R-US_0207/15  [0207/15]
R121  100  TRIM_EU-S75P  [S75P]
R122  7.985K  R-US_0207/15  [0207/15]
R123  3.3K  R-US_0207/10  [0207/10]
R124  3.83K  R-US_0207/15  [0207/15]
R125  50  TRIM_EU-S75P  [S75P]
R126  3.987K  R-US_0207/15  [0207/15]
R127  3.3K  R-US_0207/10  [0207/10]
R128  1.96K  R-US_0207/15  [0207/15]
R129  50  TRIM_EU-S75P  [S75P]
R130  1.992K  R-US_0207/15  [0207/15]
R131  3.3K  R-US_0207/10  [0207/10]
R132  1K  R-US_0207/15  [0207/15]
R133  20  TRIM_EU-S75P  [S75P]
R134  200K  R-US_0207/15  [0207/15]
R135  1K  R-US_0207/15  [0207/15]
R136  47  R-US_0207/10  [0207/10]
R137  18  R-US_0207/10  [0207/10]
R138  4.7K  R-US_0207/10  [0207/10]
R139  390  R-US_0207/10  [0207/10]
R140  18  R-US_0207/10  [0207/10]
R141  1.96K 1%  R-US_0207/15  [0207/15]
R142  8.25K  R-US_0207/15  [0207/15]
R143  133  R-US_0207/15  [0207/15]
R144  866 1%  R-US_0207/15  [0207/15]
R145  1K 1%  R-US_0207/15  [0207/15]
R146  3.9K  R-US_0207/10  [0207/10]
R147  390  R-US_0207/10  [0207/10]
R148  390  R-US_0207/10  [0207/10]
R149  1K 1%  R-US_0207/15  [0207/15]
R150  1.96K 1%  R-US_0207/15  [0207/15]
R151  8.25K 1%  R-US_0207/10  [0207/10]
R152  500  TRIM_EU-B90P  [SP19L]
R153  500  TRIM_EU-B90P  [SP19L]
R154  866 1%  R-US_0207/15  [0207/15]
R155  133  R-US_0207/15  [0207/15]
R156  18  R-US_0207/10  [0207/10]
R157  18  R-US_0207/10  [0207/10]
R158  18  R-US_0207/10  [0207/10]
R159  4.7K  R-US_0207/10  [0207/10]
R160  390  R-US_0207/10  [0207/10]
R161  4.7K  R-US_0207/10  [0207/10]
R162  390  R-US_0207/10  [0207/10]
R163  18  R-US_0207/10  [0207/10]
R164  390  R-US_0207/10  [0207/10]
R165  1K 1%  R-US_0207/15  [0207/15]
R166  10K  R-US_0207/10  [0207/10]
R167  47  R-US_0207/10  [0207/10]
W5  0  R-EU_0207/10  [0207/10]
W6  open  R-EU_0207/10  [0207/10]
W7  open  R-EU_0207/10  [0207/10]
W8  OPEN  R-EU_0207/10  [0207/10]
W9  OPEN  R-EU_0207/10  [0207/10]
W10  OPEN  R-EU_0207/10  [0207/10]

### Nets
!CHAN: F1.R1 H1.E1 J2.Z ; also sheet 1
!COL_RED: F1.L1 J2.DD ; also sheet 2
!DATA02: E31.7(B:I1) E41.4(F1) OMNIBUS1.AU1
!DATA03: E31.4(A:I0) E41.3(F0) OMNIBUS1.AV1
!DATA04: E32.4(A:I0) E40.13(F3) OMNIBUS1.BR1
!DATA05: E32.7(B:I1) E40.12(F2) OMNIBUS1.BS1
!DATA06: E32.10(C:I1) E40.4(F1) OMNIBUS1.BU1 ; also sheet 2
!DATA07: E32.12(D:I1) E40.3(F0) OMNIBUS1.BV1 ; also sheet 2
!DATA08: E31.12(D:I1) E39.13(F3) OMNIBUS1.DR1 ; also sheet 2
!DATA09: E31.9(C:I0) E39.12(F2) OMNIBUS1.DS1 ; also sheet 2
!DATA10: E39.3(F0) OMNIBUS1.DU1 ; also sheet 1
!DATA11: E39.4(F1) OMNIBUS1.DV1 ; also sheet 1
!DILE: F1.P1 H1.F1 ; also sheet 1
!DIRE: F1.B2 H1.U2 ; also sheet 1
!ERASE: F1.K1 J2.FF ; also sheet 2
!ERASE_INTERVAL: F1.D2 J2.NN ; also sheet 2
!LOAD_EN: E31.5(A:I1) E31.6(B:I0) E31.10(C:I1) E31.11(D:I0) E32.5(A:I1) E32.6(B:I0) E32.9(C:I0) E32.11(D:I0) F1.V1 R23.1 ; also sheet 1,2
!NON_STORE: F1.C2 J2.LL ; also sheet 2
!WRITE_THRU: F1.M1 J2.JJ ; also sheet 2
!X_AC: E39.7(S1) E40.7(S1) E41.7(S1) H1.K2 R24.1
!Y_AC: E39.9(S0) E40.9(S0) E41.9(S0) H1.L2 R25.1
+5V_X [supply]: D5.C D8.C D10.C D12.C D14.C D16.C D18.C D20.C D22.C D24.C E42.6(OUT) J2.UU R76.2
+5V_Y [supply]: D32.C D35.C D36.C D38.C D40.C D42.C D44.C D46.C D48.C D50.C E43.6(OUT) J2.SS R77.2
+15V: D25.C E42.7(V+) E43.7(V+) F1.D1 F1.E1 H1.R1 H1.S1 R33.2 R38.2 R41.2 R44.2 R47.2 R50.2 R53.2 R56.2 R59.2 R62.2 R72.2 R90.2 R98.2 R103.2 R106.2 R109.2 R112.2 R115.2 R120.2 R124.2 R128.2 R132.2 R163.2 ; also sheet 1
-15V [supply]: C58.- C59.- C60.- C61.- D29.A F1.F1 F1.H1 H1.N1 H1.P1 OMNIBUS1.AB2 OMNIBUS1.BB2 OMNIBUS1.CB2 R140.1 R147.1 R148.1 R158.1 ; also sheet 1
BIT10: E37.1(B) E38.1(B) F1.U1 ; also sheet 1
BIT11: E37.15(A) E38.15(A) F1.T1 ; also sheet 1
CLEAR: F1.N1 H1.H1 ; also sheet 1,2
DI02: E31.2(B:O) E33.1(B) E34.1(B)
DI03: E31.3(A:O) E33.15(A) E34.15(A)
DI04: E32.3(A:O) E35.9(D) E36.9(D)
DI05: E32.2(B:O) E35.10(C) E36.10(C)
DI06: E32.14(C:O) E35.1(B) E36.1(B)
DI07: E32.13(D:O) E35.15(A) E36.15(A)
DI08: E31.13(D:O) E37.9(D) E38.9(D)
DI09: E31.14(C:O) E37.10(C) E38.10(C)
EX_ANALOG_X: H1.B2 R141.2
EX_ANALOG_Y: H1.C2 R150.2
GND [supply]: C41.2 C42.2 C43.2 C44.2 C45.2 C46.2 C47.2 C48.2 C49.2 C50.2 C51.2 C52.2 C53.2 C54.2 C55.- C56.- C57.- C58.+ C59.+ C60.+ C61.+ C62.- C64.2 C65.2 C67.2 C68.1 C69.2 C71.2 C73.1 C75.- C76.+ C77.- C78.+ D26.A D55.C D57.C D58.C D59.C E33.9(D) E33.10(C) E33.14(CLR) E34.9(D) E34.10(C) E34.14(CLR) E35.14(CLR) E36.14(CLR) E37.14(CLR) E38.14(CLR) E42.4(V-) E43.4(V-) F1.A1 F1.B1 F1.C1 H1.T1 H1.U1 H1.V1 J2.A J2.AA J2.BB J2.C J2.CC J2.E J2.EE J2.F J2.H J2.HH J2.J J2.K J2.KK J2.M J2.MM J2.N J2.P J2.PP J2.S J2.U J2.V J2.W J2.Y OMNIBUS1.AC2 OMNIBUS1.AF1 OMNIBUS1.AF2 OMNIBUS1.AN1 OMNIBUS1.AN2 OMNIBUS1.AT1 OMNIBUS1.AT2 OMNIBUS1.BC1 OMNIBUS1.BC2 OMNIBUS1.BF1 OMNIBUS1.BF2 OMNIBUS1.BN1 OMNIBUS1.BN2 OMNIBUS1.BT1 OMNIBUS1.BT2 OMNIBUS1.CC1 OMNIBUS1.CC2 OMNIBUS1.CF1 OMNIBUS1.CF2 OMNIBUS1.CN1 OMNIBUS1.CN2 OMNIBUS1.CT1 OMNIBUS1.CT2 OMNIBUS1.DC1 OMNIBUS1.DC2 OMNIBUS1.DF1 OMNIBUS1.DF2 OMNIBUS1.DN1 OMNIBUS1.DN2 OMNIBUS1.DT1 OMNIBUS1.DT2 Q2.1(E) Q3.1(E) Q4.1(E) Q5.1(E) Q6.1(E) Q7.1(E) Q8.1(E) Q9.1(E) Q10.1(E) Q11.1(E) Q19.1(E) Q20.1(E) Q21.1(E) Q22.1(E) Q23.1(E) Q24.1(E) Q25.1(E) Q26.1(E) Q27.1(E) Q28.1(E) R32.1 R37.1 R71.1 R75.1 R76.1 R77.1 R86.1 R93.1 R97.1 R102.1 R146.2 R165.1 ; also sheet 1,2
INTENS: C63.1 F1.S1 H1.D1 R78.1 R79.1 ; also sheet 1
LOAD_X: E34.11(LD) E36.11(LD) E38.11(LD) F1.V2 ; also sheet 1
LOAD_Y: E33.11(LD) E35.11(LD) E37.11(LD) F1.U2 ; also sheet 1
N$50: E29.10(E:O) E39.2(B0)
N$51: E29.8(D:O) E39.5(B1)
N$52: E30.12(F:O) E39.11(B2)
N$53: E30.2(A:O) E39.14(B3)
N$54: E30.6(C:O) E40.2(B0)
N$55: E30.4(B:O) E40.5(B1)
N$56: E30.10(E:O) E40.11(B2)
N$57: E30.8(D:O) E40.14(B3)
N$58: E29.6(C:O) E41.2(B0)
N$59: E29.4(B:O) E41.5(B1)
N$60: E34.4(DN) E36.13(BO)
N$61: E34.5(UP) E36.12(CO)
N$62: E36.4(DN) E38.13(BO)
N$63: E36.5(UP) E38.12(CO)
N$64: E33.4(DN) E35.13(BO)
N$65: E33.5(UP) E35.12(CO)
N$66: E35.4(DN) E37.13(BO)
N$67: E35.5(UP) E37.12(CO)
N$68: D5.A R33.1 R34.2
N$69: D3.A D4.A R34.1
N$70: Q2.2(B) R30.2
N$71: D3.C Q2.3(C) R31.1 R32.2
N$72: D8.A R38.1 R39.2
N$73: D6.A D7.A R39.1
N$74: Q3.2(B) R35.2
N$75: D6.C Q3.3(C) R36.1 R37.2
N$76: D10.A R41.1 R42.2
N$77: D9.A Q4.3(C) R42.1
N$78: Q4.2(B) R40.2
N$79: D12.A R44.1 R45.2
N$80: D11.A Q5.3(C) R45.1
N$81: Q5.2(B) R43.2
N$82: D14.A R47.1 R48.2
N$83: D13.A Q6.3(C) R48.1
N$84: Q6.2(B) R46.2
N$85: D15.A Q7.3(C) R51.1
N$86: Q7.2(B) R49.2
N$87: D18.A R53.1 R66.E
N$88: D17.A Q8.3(C) R54.1
N$89: Q8.2(B) R52.2
N$90: R57.2 R67.A R67.S
N$91: D19.A Q9.3(C) R57.1
N$92: Q9.2(B) R55.2
N$93: D22.A R59.1 R68.E
N$94: D21.A Q10.3(C) R60.1
N$95: Q10.2(B) R58.2
N$96: D24.A R62.1 R69.E
N$97: D23.A Q11.3(C) R63.1 R70.1
N$98: Q11.2(B) R61.2
N$99: E29.2(A:O) R61.1
N$100: D16.A R50.1 R65.E W7.1
N$101: R51.2 R64.1
N$102: R64.2 R65.A R65.S W7.2
N$103: R54.2 R66.A R66.S
N$104: D20.A R56.1 R67.E
N$105: R60.2 R68.A R68.S
N$106: R63.2 R69.A R69.S R70.2
N$107: D32.A R98.1 R99.2
N$108: D30.A D31.A R99.1
N$109: Q19.2(B) R95.2
N$110: D30.C Q19.3(C) R96.1 R97.2
N$111: D35.A R103.1 R104.2
N$112: D33.A D34.A R104.1
N$113: C74.2 D31.C D34.C D37.C D39.C D41.C D43.C D45.C D47.C D49.C D51.C E45.2(-IN) R149.2 R151.1 R155.1
N$114: Q20.2(B) R100.2
N$115: D33.C Q20.3(C) R101.1 R102.2
N$116: D36.A R106.1 R107.2
N$117: D37.A Q21.3(C) R107.1
N$118: Q21.2(B) R105.2
N$119: D38.A R109.1 R110.2
N$120: D39.A Q22.3(C) R110.1
N$121: Q22.2(B) R108.2
N$122: D40.A R112.1 R113.2
N$123: D41.A Q23.3(C) R113.1
N$124: Q23.2(B) R111.2
N$125: D43.A Q24.3(C) R118.1
N$126: Q24.2(B) R114.2
N$127: D44.A R120.1 R121.E
N$128: D45.A Q25.3(C) R122.1
N$129: Q25.2(B) R119.2
N$130: R125.A R125.S R126.2
N$131: D47.A Q26.3(C) R126.1
N$132: Q26.2(B) R123.2
N$133: D48.A R128.1 R129.E
N$134: D49.A Q27.3(C) R130.1
N$135: Q27.2(B) R127.2
N$136: D50.A R132.1 R133.E
N$137: D51.A Q28.3(C) R134.1 R135.1
N$138: Q28.2(B) R131.2
N$139: E29.12(F:O) R131.1
N$140: D42.A R115.1 R116.E W6.1
N$141: R117.1 R118.2
N$142: R116.A R116.S R117.2 W6.2
N$143: R121.A R121.S R122.2
N$144: D46.A R124.1 R125.E
N$145: R129.A R129.S R130.2
N$146: R133.A R133.S R134.2 R135.2
N$147: D25.A Q12.2(B) R71.2
N$148: Q12.1(E) R72.1
N$149: D26.C Q12.3(C) R73.A R74.A
N$150 [supply]: C62.+ R73.E R74.E R75.2
N$151: E43.3(+IN) R73.S
N$152: E42.3(+IN) R74.S
N$153: Q31.2(B) R79.2
N$154: C63.2 Q14.2(B) Q31.3(C) R84.2
N$155 [supply]: OMNIBUS1.DB2 R84.1 R85.1
N$156: C65.1 Q14.3(C) R85.2
N$157: Q13.1(E) Q14.1(E) R86.2 R87.1
N$158: R80.2 W5.1
N$159: R81.2 W8.1
N$160: Q13.2(B) R83.2
N$161: R83.1 W5.2 W8.2
N$162: C64.1 Q13.3(C) R82.1
N$163: C75.+ E44.7(V+) R88.1 R89.1 R90.1
N$164: C66.1 R91.2
N$165: C66.2 E44.8(ON2)
N$166: E44.1(ON1) R91.1
N$167: D27.C D28.C D56.C E44.6(OUT)
N$168: D56.A D57.A
N$169: D27.A Q15.2(B) R88.2
N$170: C67.1 Q15.3(C) R89.2
N$171: D28.A Q16.2(B) R138.2
N$172: C68.2 Q16.3(C) R139.2
N$173: C76.- E44.4(V-) R138.1 R139.1 R140.2
N$174: E44.5(OPT) R94.2
N$175: C70.1 R92.2 R94.1 R136.1 R137.2 R144.2 W9.2
N$176: Q16.1(E) R137.1
N$177: Q15.1(E) R92.1
N$178: E44.3(+IN) R93.2
N$179: R143.2 R144.1 W9.1
N$180: C70.2 D4.C D7.C D9.C D11.C D13.C D15.C D17.C D19.C D21.C D23.C E44.2(-IN) R142.1 R143.1 R145.2
N$181: C69.1 R141.1 R142.2
N$182: R145.1 R152.A
N$183: D29.C Q17.2(B) Q18.2(B) R146.1
N$184: Q18.1(E) R148.2
N$185: Q17.1(E) R147.2
N$186: D59.A Q18.3(C) R152.E R152.S
N$187: D58.A Q17.3(C) R153.A R153.S
N$188: R149.1 R153.E
N$189: C77.+ E45.7(V+) R161.2 R162.2 R163.1
N$190: C72.2 E45.8(ON2)
N$191: E45.1(ON1) R164.1
N$192: D52.C D53.C D54.C E45.6(OUT)
N$193: D52.A Q29.2(B) R161.1
N$194: C42.1 Q29.3(C) R162.1
N$195: D53.A Q30.2(B) R159.2
N$196: C73.2 Q30.3(C) R160.2
N$197: C78.- E45.4(V-) R158.2 R159.1 R160.1
N$198: E45.5(OPT) R166.2
N$199: C74.1 R154.2 R156.2 R157.2 R166.1 R167.1 W10.2
N$200: Q30.1(E) R157.1
N$201: Q29.1(E) R156.1
N$202: E45.3(+IN) R165.2
N$203: R154.1 R155.2 W10.1
N$204: C71.1 R150.1 R151.2
N$205: D54.A D55.A
N$206: C72.1 R164.2
VCC [supply]: C41.1 C43.1 C44.1 C45.1 C46.1 C47.1 C48.1 C49.1 C50.1 C51.1 C52.1 C53.1 C54.1 C55.+ C56.+ C57.+ OMNIBUS1.AA2 OMNIBUS1.BA2 OMNIBUS1.CA2 Q31.1(E) R23.2 R24.2 R25.2 R26.2 R27.2 R28.2 R29.2 R31.2 R36.2 R78.2 R80.1 R81.1 R82.2 R96.2 R101.2 ; also sheet 1,2
X02: E29.1(A:I) E34.2(QB) E41.6(A1)
X03: E34.3(QA) E41.1(A0) R58.1
X04: E36.7(QD) E40.15(A3) R55.1
X05: E36.6(QC) E40.10(A2) R52.1
X06: E36.2(QB) E40.6(A1) R49.1
X07: E36.3(QA) E40.1(A0) R46.1
X08: E38.7(QD) E39.15(A3) R43.1
X09: E38.6(QC) E39.10(A2) R40.1
X10: E38.2(QB) E39.6(A1) R35.1
X11: E38.3(QA) E39.1(A0) R30.1
X_ANALOG: H1.C1 J2.D R136.2
X_DEC: E38.4(DN) H1.H2 R27.1
X_INC: E38.5(UP) H1.E2 R26.1
Y02: E29.3(B:I) E29.13(F:I) E33.2(QB)
Y03: E29.5(C:I) E33.3(QA) R127.1
Y04: E30.9(D:I) E35.7(QD) R123.1
Y05: E30.11(E:I) E35.6(QC) R119.1
Y06: E30.3(B:I) E35.2(QB) R114.1
Y07: E30.5(C:I) E35.3(QA) R111.1
Y08: E30.1(A:I) E37.7(QD) R108.1
Y09: E30.13(F:I) E37.6(QC) R105.1
Y10: E29.9(D:I) E37.2(QB) R100.1
Y11: E29.11(E:I) E37.3(QA) R95.1
Y_ANALOG: H1.A1 J2.L R167.2
Y_DEC: E37.4(DN) H1.J2 R29.1
Y_INC: E37.5(UP) H1.F2 R28.1
Z_AXIS: J2.X R87.2
Z_PULSE: F1.A2 H1.V2 ; also sheet 1
Unconnected: E33.6(QC) E33.7(QD) E33.12(CO) E33.13(BO) E34.6(QC) E34.7(QD) E34.12(CO) E34.13(BO) E41.10(A2) E41.11(B2) E41.12(F2) E41.13(F3) E41.14(B3) E41.15(A3) E42.1(ON1) E42.2(-IN) E42.5(OPT) E42.8(ON2) E43.1(ON1) E43.2(-IN) E43.5(OPT) E43.8(ON2) F1.E2 F1.F2 F1.H2 F1.J1 F1.J2 F1.K2 F1.L2 F1.M2 F1.N2 F1.P2 F1.R2 F1.S2 F1.T2 H1.A2 H1.B1 H1.D2 H1.J1 H1.K1 H1.L1 H1.M1 H1.M2 H1.N2 H1.P2 H1.R2 H1.S2 H1.T2 J2.B J2.R J2.RR J2.T J2.TT J2.VV OMNIBUS1.AA1 OMNIBUS1.AB1 OMNIBUS1.AC1 OMNIBUS1.AD1 OMNIBUS1.AD2 OMNIBUS1.AE1 OMNIBUS1.AE2 OMNIBUS1.AH1 OMNIBUS1.AH2 OMNIBUS1.AJ1 OMNIBUS1.AJ2 OMNIBUS1.AK1 OMNIBUS1.AK2 OMNIBUS1.AL1 OMNIBUS1.AL2 OMNIBUS1.AM1 OMNIBUS1.AM2 OMNIBUS1.AP1 OMNIBUS1.AP2 OMNIBUS1.AR1 OMNIBUS1.AR2 OMNIBUS1.AS1 OMNIBUS1.AS2 OMNIBUS1.AU2 OMNIBUS1.AV2 OMNIBUS1.BA1 OMNIBUS1.BB1 OMNIBUS1.BD1 OMNIBUS1.BD2 OMNIBUS1.BE1 OMNIBUS1.BE2 OMNIBUS1.BH1 OMNIBUS1.BH2 OMNIBUS1.BJ1 OMNIBUS1.BJ2 OMNIBUS1.BK1 OMNIBUS1.BK2 OMNIBUS1.BL1 OMNIBUS1.BL2 OMNIBUS1.BM1 OMNIBUS1.BM2 OMNIBUS1.BP1 OMNIBUS1.BP2 OMNIBUS1.BR2 OMNIBUS1.BS2 OMNIBUS1.BU2 OMNIBUS1.BV2 OMNIBUS1.CA1 OMNIBUS1.CB1 OMNIBUS1.CD1 OMNIBUS1.CD2 OMNIBUS1.CE1 OMNIBUS1.CE2 OMNIBUS1.CH1 OMNIBUS1.CH2 OMNIBUS1.CJ1 OMNIBUS1.CJ2 OMNIBUS1.CK1 OMNIBUS1.CK2 OMNIBUS1.CL1 OMNIBUS1.CL2 OMNIBUS1.CM1 OMNIBUS1.CM2 OMNIBUS1.CP1 OMNIBUS1.CP2 OMNIBUS1.CR1 OMNIBUS1.CR2 OMNIBUS1.CS1 OMNIBUS1.CS2 OMNIBUS1.CU1 OMNIBUS1.CU2 OMNIBUS1.CV1 OMNIBUS1.CV2 OMNIBUS1.DA1 OMNIBUS1.DA2 OMNIBUS1.DB1 OMNIBUS1.DD1 OMNIBUS1.DD2 OMNIBUS1.DE1 OMNIBUS1.DE2 OMNIBUS1.DH1 OMNIBUS1.DH2 OMNIBUS1.DJ1 OMNIBUS1.DJ2 OMNIBUS1.DK1 OMNIBUS1.DK2 OMNIBUS1.DL1 OMNIBUS1.DL2 OMNIBUS1.DM1 OMNIBUS1.DM2 OMNIBUS1.DP1 OMNIBUS1.DP2 OMNIBUS1.DR2 OMNIBUS1.DS2 OMNIBUS1.DU2 OMNIBUS1.DV2

### Notes on the sheet
- M885 Point Plot D/A
- E-CS-M885-0-1 | F

## Power pins joined to a net without a drawn wire
GND: E1.8(P:GND) E2.8(P:GND) E3.7(P:GND) E4.7(GND) E5.7(P:GND) E6.7(P:GND) E7.7(P:GND) E8.7(P:GND) E9.1(P:GND) E10.7(P:GND) E11.1(P:GND) E12.1(GND) E13.1(P:GND) E14.7(P:GND) E15.7(GND) E16.7(P:GND) E17.7(P:GND) E18.7(P:GND) E19.7(P:GND) E20.7(P:GND) E21.7(P:GND) E22.7(P:GND) E23.7(P:GND) E24.1(P:GND) E25.8(GND) E26.7(P:GND) E27.7(P:GND) E28.7(P:GND) E29.7(P:GND) E30.7(P:GND) E31.1(P:GND) E32.1(P:GND) E33.8(GND) E34.8(GND) E35.8(GND) E36.8(GND) E37.8(GND) E38.8(GND) E39.8(GND) E40.8(GND) E41.8(GND)
VCC: E1.16(P:VCC) E2.16(P:VCC) E3.14(P:VCC) E4.14(VCC) E5.14(P:VCC) E6.14(P:VCC) E7.14(P:VCC) E8.14(P:VCC) E9.8(P:VCC) E10.14(P:VCC) E11.8(P:VCC) E12.8(VCC) E13.8(P:VCC) E14.14(P:VCC) E15.14(VCC) E16.14(P:VCC) E17.14(P:VCC) E18.14(P:VCC) E19.14(P:VCC) E20.14(P:VCC) E21.14(P:VCC) E22.14(P:VCC) E23.14(P:VCC) E24.8(P:VCC) E25.16(VCC) E26.14(P:VCC) E27.14(P:VCC) E28.14(P:VCC) E29.14(P:VCC) E30.14(P:VCC) E31.8(P:VCC) E32.8(P:VCC) E33.16(VCC) E34.16(VCC) E35.16(VCC) E36.16(VCC) E37.16(VCC) E38.16(VCC) E39.16(VCC) E40.16(VCC) E41.16(VCC)

## Library data of the parts
C1-C28 C34-C37 C39-C41 C43-C54 C63-C65 C69-C71 C74 = dec-con:C-US: Capacitors with funky DEC lead spacing.
C29-C32 C55-C62 C75-C78 = dec-con:CPOL-USE20-8AXIAL: A 0.8 inch electrolytic.
C33 C38 C42 C66-C68 C72 C73 = rcl:C-US: CAPACITOR, American symbol
D1-D24 D27 D28 D30-D53 = diode:DIODE-: DIODE
D25 D26 D29 D54-D59 = diode:ZENER-DIODE: Z-Diode
E1 E2 = 74xx-us:74*123: Retriggerable monostable MULTIVIBRATOR
E3 E20 = 74xx-us:74*02: Quad 2-input NOR gate
E4 E15 = dec-con:9601: DEC9601 monstable
E5 E6 E18 E19 = 74xx-us:74*74: Dual D type positive edge triggered FLIP FLOP, preset and clear
E7 E8 E16 E17 = dec-con:N8881: Quad 2-input NAND gate, open collector
E9 E11 E13 E24 E31 E32 = dec-con:SP380: Quad NOR gate (use 8640)
E10 = 74xx-us:74*06: Hex INVERTER, open collector high-voltage output
E12 = dec-con:SP314: 7-Input NOR gate
E14 E21 E29 E30 = 74xx-us:74*04: Hex INVERTER
E22 E26 E27 = 74xx-us:74*00: Quad 2-input NAND gate
E23 = 74xx-us:74*21: Dual 4-input AND gate
E25 = dec-con:DEC8251: BCD Decoder
E28 = 74xx-us:74*16: Hex INVERTER, open collector, high-voltage
E33-E38 = dec-con:74*193: Synchronous 4-bit UP/DOWN COUNTER
E39-E41 = dec-con:DEC8235: 4-bit data selector
E42-E45 = linear:AD504: OP AMP
F F1 H H1 = dec-con:EDGE-TOP: Labeled DEC edge connector, suitable for top connector.
J1 = dec-con:1-480459-0: Mate-N-Lok 1-480459-0, board mounted.
J2 = dec-con:DEC40PIN: PIN HEADER
OMNIBUS OMNIBUS1 = dec-con:QUAD: Quad-Height DEC board
Q1-Q11 Q13 Q15 Q17-Q29 = transistor:*-NPN-: NPN Transistror BF959 corrected 2008.03.06
Q12 Q14 Q16 Q30 Q31 = transistor:*-PNP-: PNP Transistror
R1-R64 R70-R72 R75-R115 R117-R120 R122-R124 R126-R128 R130-R132 R134-R151 R154-R167 = rcl:R-US_: RESISTOR, American symbol
R65-R69 R73 R74 R116 R121 R125 R129 R133 R152 R153 = pot:TRIM_EU-: POTENTIOMETER
S1 S2 = dec-con:12-09698: 12-09698 Slide Switch
TP1 TP2 = testpad:TPSQ: Test pad
W1-W4 = jumper:0R: Bridge 0R 10mm
W5-W10 = rcl:R-EU_: RESISTOR, European symbol

## Net classes
1 supply: width 0.813 mm